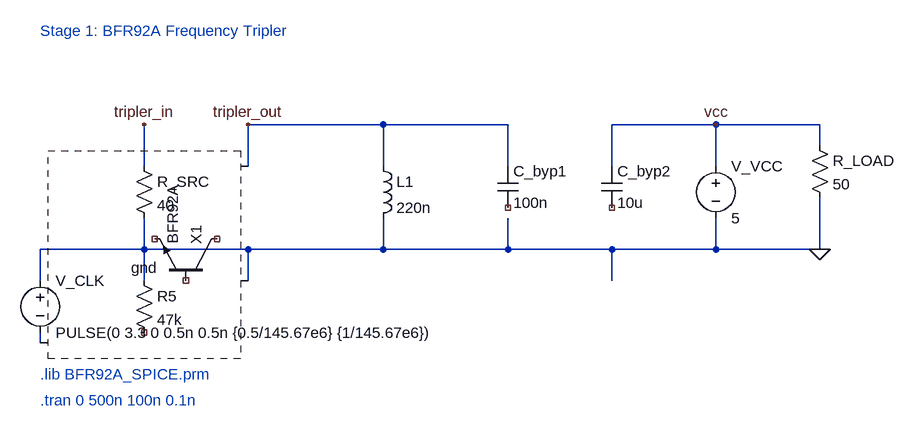
[diagram p0: schematic TX_Chain.asc]
TX_Chain.asc, the LTspice schematic file:
Version 4
SHEET 1 1800 900
WIRE 160 160 160 96
WIRE 160 288 160 240
WIRE 160 288 0 288
WIRE 0 288 0 336
WIRE 160 336 160 288
WIRE 320 288 160 288
WIRE 320 288 320 336
WIRE 320 160 320 96
WIRE 528 96 320 96
WIRE 528 96 528 160
WIRE 528 288 528 240
WIRE 528 288 320 288
WIRE 720 96 528 96
WIRE 720 96 720 160
WIRE 720 288 720 240
WIRE 720 288 528 288
WIRE 880 288 720 288
WIRE 880 288 880 336
WIRE 880 160 880 96
WIRE 1040 96 880 96
WIRE 1040 96 1040 160
WIRE 1040 288 1040 240
WIRE 1040 288 880 288
WIRE 1200 96 1040 96
WIRE 1200 128 1200 96
WIRE 1200 288 1200 208
WIRE 1200 288 1040 288
WIRE 0 432 0 416
TEXT 0 -48 Left 2 Stage 1: BFR92A Frequency Tripler
TEXT 0 480 Left 2 .lib BFR92A_SPICE.prm
TEXT 0 520 Left 2 .tran 0 500n 100n 0.1n
SYMBOL voltage 0 320 R0
SYMATTR InstName V_CLK
SYMATTR Value PULSE(0 3.3 0 0.5n 0.5n {0.5/145.67e6} {1/145.67e6})
SYMBOL res 144 144 R0
SYMATTR InstName R_SRC
SYMATTR Value 40
SYMBOL res 144 320 R0
SYMATTR InstName R5
SYMATTR Value 47k
SYMBOL NPN 272 336 M270
SYMATTR InstName X1
SYMATTR Value BFR92A
SYMBOL ind 512 144 R0
SYMATTR InstName L1
SYMATTR Value 220n
SYMBOL cap 704 160 R0
SYMATTR InstName C_byp1
SYMATTR Value 100n
SYMBOL cap 864 160 R0
SYMATTR InstName C_byp2
SYMATTR Value 10u
SYMBOL voltage 1040 144 R0
SYMATTR InstName V_VCC
SYMATTR Value 5
SYMBOL res 1184 112 R0
SYMATTR InstName R_LOAD
SYMATTR Value 50
SYMBOL gnd 0 432 R0
FLAG 1200 288 0
FLAG 160 96 tripler_in
FLAG 320 96 tripler_out
FLAG 1040 96 vcc

The netlist it stands for:
* TX_Chain.asc
V_CLK 0 N001 PULSE(0 3.3 0 0.5n 0.5n {0.5/145.67e6} {1/145.67e6})
R_SRC tripler_in 0 40
R5 0 NC_01 47k
Q§X1 NC_02 NC_03 NC_04 0 BFR92A
L1 tripler_out 0 220n
C_byp1 tripler_out NC_05 100n
C_byp2 vcc NC_06 10u
V_VCC vcc 0 5
R_LOAD vcc 0 50
* ?: gnd (symbol gnd not available, pin order unknown); nets seen at it: 0, N001, tripler_out
.model NPN NPN
.model PNP PNP
.lib standard.bjt
* Stage 1: BFR92A Frequency Tripler
* .lib BFR92A_SPICE.prm
* .tran 0 500n 100n 0.1n
.backanno
.end